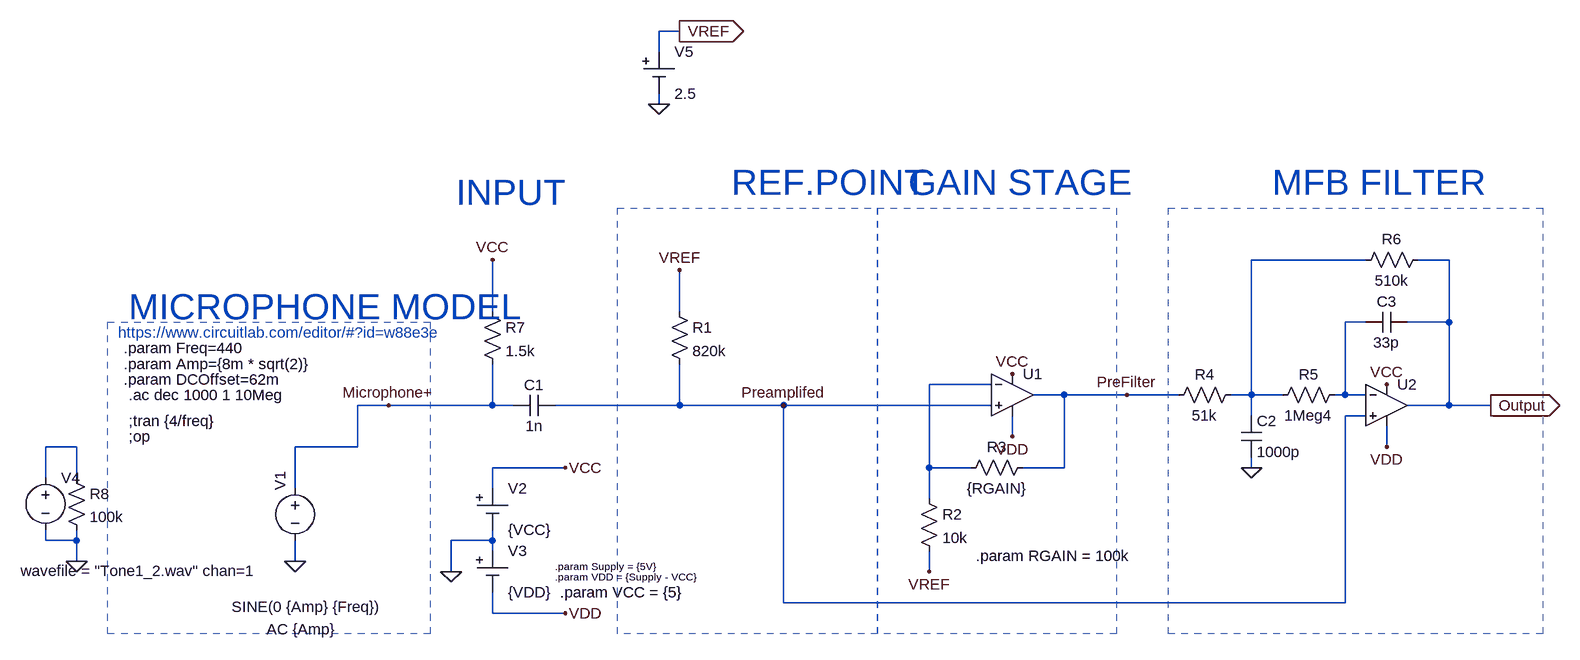
[diagram p0: schematic MFBFilter_REV3.asc]
MFBFilter_REV3.asc, the LTspice schematic file:
Version 4
SHEET 1 2420 1264
WIRE 0 -912 -32 -912
WIRE -32 -880 -32 -912
WIRE -32 -800 -32 -816
WIRE 1056 -560 880 -560
WIRE 1184 -560 1136 -560
WIRE -288 -480 -288 -560
WIRE 0 -480 0 -544
WIRE 1056 -464 1024 -464
WIRE 1184 -464 1184 -560
WIRE 1184 -464 1120 -464
WIRE 480 -368 384 -368
WIRE 592 -352 544 -352
WIRE 688 -352 592 -352
WIRE 768 -352 688 -352
WIRE 880 -352 880 -560
WIRE 880 -352 848 -352
WIRE 928 -352 880 -352
WIRE 1024 -352 1024 -464
WIRE 1024 -352 1008 -352
WIRE 1056 -352 1024 -352
WIRE -448 -336 -496 -336
WIRE -288 -336 -288 -400
WIRE -288 -336 -448 -336
WIRE -256 -336 -288 -336
WIRE 0 -336 0 -400
WIRE 0 -336 -192 -336
WIRE 160 -336 0 -336
WIRE 480 -336 160 -336
WIRE 1184 -336 1184 -464
WIRE 1184 -336 1120 -336
WIRE 1248 -336 1184 -336
WIRE 880 -320 880 -352
WIRE 1056 -320 1024 -320
WIRE 512 -288 512 -320
WIRE -928 -272 -976 -272
WIRE -496 -272 -496 -336
WIRE -496 -272 -592 -272
WIRE 1088 -272 1088 -304
WIRE -176 -240 -288 -240
WIRE 384 -240 384 -368
WIRE 448 -240 384 -240
WIRE 592 -240 592 -352
WIRE 592 -240 528 -240
WIRE 880 -240 880 -256
WIRE -976 -224 -976 -272
WIRE -928 -224 -928 -272
WIRE -592 -208 -592 -272
WIRE -288 -208 -288 -240
WIRE 384 -192 384 -240
WIRE -976 -128 -976 -144
WIRE -928 -128 -928 -144
WIRE -928 -128 -976 -128
WIRE -288 -128 -288 -144
WIRE -288 -128 -352 -128
WIRE -288 -112 -288 -128
WIRE -928 -96 -928 -128
WIRE -592 -96 -592 -128
WIRE -352 -80 -352 -128
WIRE 384 -80 384 -112
WIRE 160 -32 160 -336
WIRE 1024 -32 1024 -320
WIRE 1024 -32 160 -32
WIRE -288 -16 -288 -48
WIRE -176 -16 -288 -16
FLAG 384 -80 VREF
FLAG 880 -240 0
FLAG -288 -560 VCC
FLAG 1088 -368 VCC
FLAG 512 -384 VCC
FLAG 1248 -336 Output
IOPIN 1248 -336 Out
FLAG 160 -336 Preamplifed
FLAG 688 -352 PreFilter
FLAG -448 -336 Microphone+
FLAG -352 -80 0
FLAG -176 -240 VCC
FLAG -176 -16 VDD
FLAG 1088 -272 VDD
FLAG 512 -288 VDD
FLAG -592 -96 0
FLAG 0 -544 VREF
FLAG -928 -96 0
FLAG 0 -912 VREF
IOPIN 0 -912 Out
FLAG -32 -800 0
DATAFLAG -224 -240 ""
DATAFLAG -288 -336 ""
DATAFLAG 160 -320 ""
SYMBOL res -16 -496 R0
SYMATTR InstName R1
SYMATTR Value 820k
SYMBOL cap -192 -352 R90
WINDOW 0 0 32 VBottom 2
WINDOW 3 32 32 VTop 2
SYMATTR InstName C1
SYMATTR Value 1n
SYMBOL res 368 -208 R0
SYMATTR InstName R2
SYMATTR Value 10k
SYMBOL res 544 -256 R90
WINDOW 0 0 56 VBottom 2
WINDOW 3 32 56 VTop 2
SYMATTR InstName R3
SYMATTR Value {RGAIN}
SYMBOL res 864 -368 R90
WINDOW 0 0 56 VBottom 2
WINDOW 3 32 56 VTop 2
SYMATTR InstName R4
SYMATTR Value 51k
SYMBOL res 1024 -368 R90
WINDOW 0 0 56 VBottom 2
WINDOW 3 32 56 VTop 2
SYMATTR InstName R5
SYMATTR Value 1Meg4
SYMBOL res 1152 -576 R90
WINDOW 0 0 56 VBottom 2
WINDOW 3 32 56 VTop 2
SYMATTR InstName R6
SYMATTR Value 510k
SYMBOL cap 864 -320 R0
SYMATTR InstName C2
SYMATTR Value 1000p
SYMBOL cap 1120 -480 R90
WINDOW 0 0 32 VBottom 2
WINDOW 3 32 32 VTop 2
SYMATTR InstName C3
SYMATTR Value 33p
SYMBOL voltage -592 -224 R0
WINDOW 3 134 198 Right 2
WINDOW 123 62 233 Right 2
WINDOW 39 0 0 Left 0
WINDOW 0 -23 -10 VRight 2
SYMATTR Value SINE(0 {Amp} {Freq})
SYMATTR Value2 AC {Amp}
SYMATTR InstName V1
SYMBOL res -304 -496 R0
SYMATTR InstName R7
SYMATTR Value 1.5k
SYMBOL Misc\\cell -288 -208 R0
WINDOW 123 0 0 Left 0
WINDOW 39 0 0 Left 0
SYMATTR InstName V2
SYMATTR Value {VCC}
SYMBOL Misc\\cell -288 -112 R0
WINDOW 123 0 0 Left 0
WINDOW 39 0 0 Left 0
SYMATTR InstName V3
SYMATTR Value {VDD}
SYMBOL Opamps\\UniversalOpamp2 512 -352 R0
SYMATTR InstName U1
SYMBOL Opamps\\UniversalOpamp2 1088 -336 R0
SYMATTR InstName U2
SYMBOL voltage -976 -240 R0
WINDOW 3 -38 159 Left 2
WINDOW 123 0 0 Left 0
WINDOW 39 0 0 Left 0
SYMATTR Value wavefile = "Tone1_2.wav" chan=1
SYMATTR InstName V4
SYMBOL res -944 -240 R0
SYMATTR InstName R8
SYMATTR Value 100k
SYMBOL Misc\\cell -32 -880 R0
WINDOW 123 0 0 Left 0
WINDOW 39 0 0 Left 0
SYMATTR InstName V5
SYMATTR Value 2.5
TEXT 352 -680 Left 5 ;GAIN STAGE
TEXT -344 -664 Left 5 ;INPUT
TEXT 912 -680 Left 5 ;MFB FILTER
TEXT 80 -680 Left 5 ;REF.POINT
TEXT -848 -352 Left 2 !.ac dec 1000 1 10Meg
TEXT -848 -312 Left 2 !;tran {4/freq}
TEXT -856 -424 Left 2 !.param Freq=440
TEXT -856 -400 Left 2 !.param Amp={8m * sqrt(2)}
TEXT -856 -376 Left 2 !.param DCOffset=62m
TEXT -848 -488 Left 5 ;MICROPHONE MODEL
TEXT -864 -448 Left 2 ;https://www.circuitlab.com/editor/#?id=w88e3e
TEXT -192 -88 Left 1 !.param Supply = {5V}
TEXT -192 -72 Left 1 !.param VDD = {Supply - VCC}
TEXT -184 -48 Left 2 !.param VCC = {5}
TEXT -848 -288 Left 2 !;op
TEXT 456 -104 Left 2 !.param RGAIN = 100k
RECTANGLE Normal 672 16 304 -640 2
RECTANGLE Normal 1328 16 752 -640 2
RECTANGLE Normal 304 16 -96 -640 2
RECTANGLE Normal -880 -464 -384 16 2

The netlist it stands for:
* MFBFilter_REV3.asc
R1 VREF Preamplifed 820k
C1 Preamplifed Microphone+ 1n
R2 N003 VREF 10k
R3 PreFilter N003 {RGAIN}
R4 N001 PreFilter 51k
R5 N002 N001 1Meg4
R6 Output N001 510k
C2 N001 0 1000p
C3 Output N002 33p
V1 Microphone+ 0 SINE(0 {Amp} {Freq}) AC {Amp}
R7 VCC Microphone+ 1.5k
V2 VCC 0 {VCC}
V3 0 VDD {VDD}
XU1 Preamplifed N003 VCC VDD PreFilter level.2 Avol=1Meg GBW=10Meg Slew=10Meg ilimit=25m rail=0 Vos=0 phimargin=45 en=0 enk=0 in=0 ink=0 Rin=500Meg  ; pins IN+ IN- V+ V- OUT
XU2 Preamplifed N002 VCC VDD Output level.2 Avol=1Meg GBW=10Meg Slew=10Meg ilimit=25m rail=0 Vos=0 phimargin=45 en=0 enk=0 in=0 ink=0 Rin=500Meg  ; pins IN+ IN- V+ V- OUT
V4 N004 0 wavefile = "Tone1_2.wav" chan=1
R8 N004 0 100k
V5 VREF 0 2.5
* GAIN STAGE
* INPUT
* MFB FILTER
* REF.POINT
.ac dec 1000 1 10Meg
;tran {4/freq}
.param Freq=440
.param Amp={8m * sqrt(2)}
.param DCOffset=62m
* MICROPHONE MODEL
* https://www.circuitlab.com/editor/#?id=w88e3e
.param Supply = {5V}
.param VDD = {Supply - VCC}
.param VCC = {5}
;op
.param RGAIN = 100k
.lib UniversalOpamps2.sub
.backanno
.end